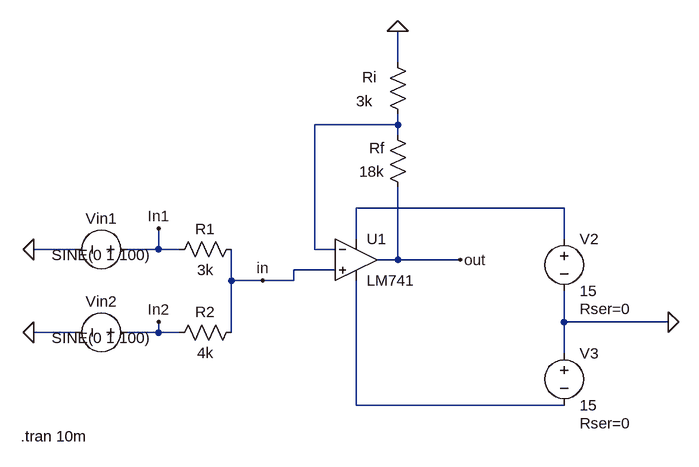
[diagram p0: schematic LM741nonInvertingSummingAmplifier.asc]
LM741nonInvertingSummingAmplifier.asc, the LTspice schematic file:
Version 4
SHEET 1 880 680
WIRE 256 -160 256 -208
WIRE 256 -64 256 -80
WIRE 256 -64 128 -64
WIRE 256 -48 256 -64
WIRE 512 64 192 64
WIRE 192 112 192 64
WIRE 512 112 512 64
WIRE -240 128 -304 128
WIRE -112 128 -112 96
WIRE -112 128 -160 128
WIRE -80 128 -112 128
WIRE 128 128 128 -64
WIRE 160 128 128 128
WIRE 256 144 256 32
WIRE 256 144 224 144
WIRE 352 144 256 144
WIRE 160 160 96 160
WIRE 0 176 0 128
WIRE 48 176 0 176
WIRE 96 176 96 160
WIRE 96 176 48 176
WIRE 512 240 512 192
WIRE 672 240 512 240
WIRE -240 256 -304 256
WIRE -112 256 -112 240
WIRE -112 256 -160 256
WIRE -80 256 -112 256
WIRE 0 256 0 176
WIRE 512 288 512 240
WIRE 192 368 192 176
WIRE 512 368 192 368
FLAG 48 176 in
FLAG 352 144 out
FLAG 672 240 0
FLAG 256 -208 0
FLAG -304 128 0
FLAG -304 256 0
FLAG -112 96 In1
FLAG -112 240 In2
SYMBOL LM741 192 80 R0
SYMATTR InstName U1
SYMBOL voltage 512 96 R0
WINDOW 123 0 0 Left 0
WINDOW 39 24 124 Left 2
SYMATTR SpiceLine Rser=0
SYMATTR InstName V2
SYMATTR Value 15
SYMBOL res 272 48 R180
WINDOW 0 36 76 Left 2
WINDOW 3 36 40 Left 2
SYMATTR InstName Rf
SYMATTR Value 18k
SYMBOL voltage 512 272 R0
WINDOW 123 0 0 Left 0
WINDOW 39 24 124 Left 2
SYMATTR SpiceLine Rser=0
SYMATTR InstName V3
SYMATTR Value 15
SYMBOL res 16 112 R90
WINDOW 0 0 56 VBottom 2
WINDOW 3 32 56 VTop 2
SYMATTR InstName R1
SYMATTR Value 3k
SYMBOL res 16 240 R90
WINDOW 0 0 56 VBottom 2
WINDOW 3 32 56 VTop 2
SYMATTR InstName R2
SYMATTR Value 4k
SYMBOL voltage -144 128 R90
WINDOW 0 -32 56 VBottom 2
WINDOW 3 24 56 VBottom 2
WINDOW 123 52 56 VBottom 2
WINDOW 39 0 0 Left 0
SYMATTR InstName Vin1
SYMATTR Value SINE(0 1 100)
SYMBOL voltage -144 256 R90
WINDOW 0 -32 56 VBottom 2
WINDOW 3 24 56 VBottom 2
WINDOW 123 52 56 VBottom 2
WINDOW 39 0 0 Left 0
SYMATTR InstName Vin2
SYMATTR Value SINE(0 1 100)
SYMBOL res 240 -176 R0
WINDOW 0 -39 39 Left 2
WINDOW 3 -48 76 Left 2
SYMATTR InstName Ri
SYMATTR Value 3k
TEXT -324 416 Left 2 !.tran 10m

The netlist it stands for:
* LM741nonInvertingSummingAmplifier.asc
XU1 in N001 N002 N003 out LM741  ; pins In+ In- V+ V- OUT
V2 N002 0 15 Rser=0
Rf out N001 18k
V3 0 N003 15 Rser=0
R1 in In1 3k
R2 in In2 4k
Vin1 In1 0 SINE(0 1 100)
Vin2 In2 0 SINE(0 1 100)
Ri 0 N001 3k
.tran 10m
.lib LM741.lib
.backanno
.end